# Altium schematic sheet nuc972_power.SchDoc
size A4
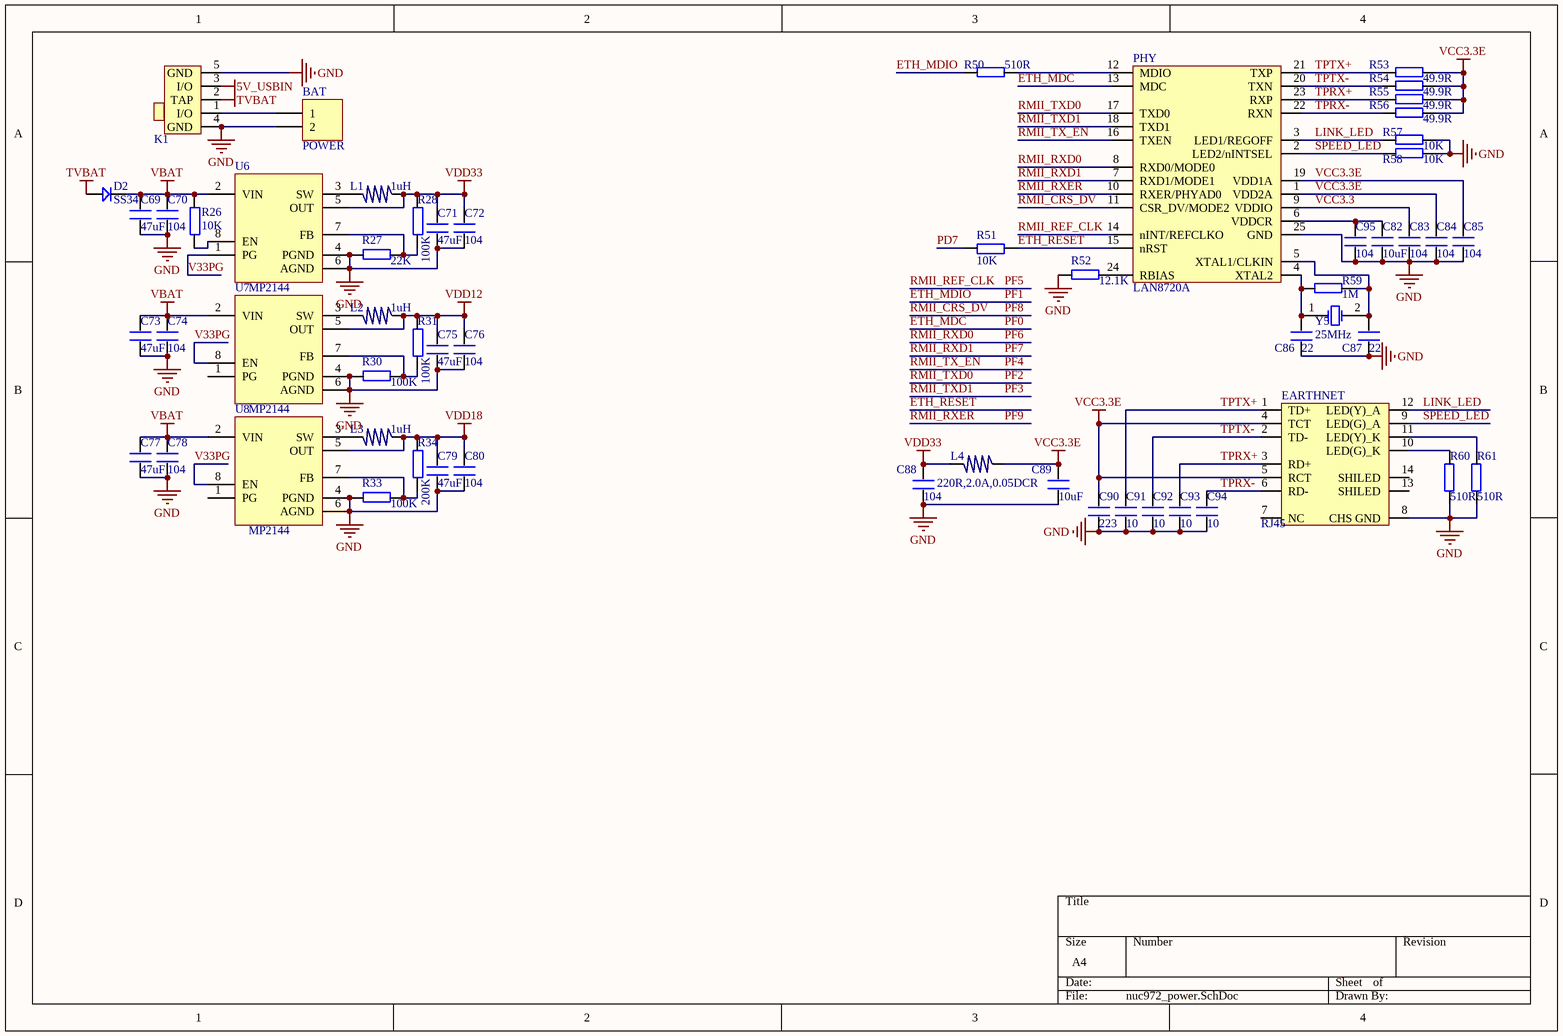
[diagram p0: nuc972_power.SchDoc]

## Parts
BAT  POWER  [HDR1X2]
C69  47uF  [C 0805_L]
C70  104  [C 0603_L]
C71  47uF  [C 0805_L]
C72  104  [C 0603_L]
C73  47uF  [C 0805_L]
C74  104  [C 0603_L]
C75  47uF  [C 0805_L]
C76  104  [C 0603_L]
C77  47uF  [C 0805_L]
C78  104  [C 0603_L]
C79  47uF  [C 0805_L]
C80  104  [C 0603_L]
C82  10uF  [C 0603_L]
C83  104  [C 0603_L]
C84  104  [C 0603_L]
C85  104  [C 0603_L]
C86  22  [C 0603_L]
C87  22  [C 0603_L]
C88  104  [C 0603_L]
C89  10uF  [C 0603_L]
C90  223  [C 0603_L]
C91  10  [C 0603_L]
C92  10  [C 0603_L]
C93  10  [C 0603_L]
C94  10  [C 0603_L]
C95  104  [C 0603_L]
D2  SS34  [SMA]
EARTHNET  RJ45  [RJ-45A12]
K1  BUTTON_DIP3  [BTN8.8*4.6]  (value not drawn)
L1  1uH  [NR3015]
L2  1uH  [NR3015]
L3  1uH  [NR3015]
L4  220R,2.0A,0.05DCR  [L 0603]
PHY  LAN8720A  [QFN24 4x4_N]
R26  10K  [R 0603_L]
R27  22K  [R 0603_L]
R28  100K  [R 0603_L]
R30  100K  [R 0603_L]
R31  100K  [R 0603_L]
R33  100K  [R 0603_L]
R34  200K  [R 0603_L]
R50  510R  [R 0603_L]
R51  10K  [R 0603_L]
R52  12.1K  [R 0603_L]
R53  49.9R  [R 0603_L]
R54  49.9R  [R 0603_L]
R55  49.9R  [R 0603_L]
R56  49.9R  [R 0603_L]
R57  10K  [R 0603_L]
R58  10K  [R 0603_L]
R59  1M  [R 0603_L]
R60  510R  [R 0603_L]
R61  510R  [R 0603_L]
U6  MP2144  [SOT23-8L]
U7  MP2144  [SOT23-8L]
U8  MP2144  [SOT23-8L]
Y5  25MHz  [OSC HC-49S]

## Nets
5V_USBIN: K1.3(I/O)
GND: BAT.2 C69.1 C70.1 C71.1 C72.1 C73.1 C74.1 C75.1 C76.1 C77.1 C78.1 C79.1 C80.1 C82.1 C83.2 C84.2 C85.2 C86.2 C87.2 C88.2 C89.2 C90.2 C91.2 C92.2 C93.2 C94.2 C95.2 EARTHNET.8(CHS_GND) K1.4(GND) K1.5(GND) PHY.25(GND) R27.2 R30.2 R33.2 R52.2 R57.1 R58.1 R60.2 R61.2 U6.4(PGND) U6.6(AGND) U7.4(PGND) U7.6(AGND) U8.4(PGND) U8.6(AGND)
TVBAT: D2.1 K1.2(TAP)
VBAT: C69.2 C70.2 C73.2 C74.2 C77.2 C78.2 D2.2 R26.2 U6.2(VIN) U7.2(VIN) U8.2(VIN)
VCC3.3E: C84.1 C85.1 C89.1 C90.1 EARTHNET.4(TCT) EARTHNET.5(RCT) L4.1 PHY.1(VDD2A) PHY.19(VDD1A) R53.1 R54.1 R55.1 R56.1
VDD12: C75.2 C76.2 L2.1 R31.2 U7.5(OUT)
VDD18: C79.2 C80.2 L3.1 R34.2 U8.5(OUT)
VDD33: C71.2 C72.2 C88.1 L1.1 L4.2 R28.2 U6.5(OUT)
ETH_MDC: PHY.13(MDC)  [also labelled PF0]
ETH_MDIO: R50.2  [also labelled PF1]
ETH_RESET: PHY.15(nRST) R51.2
LINK_LED: EARTHNET.12(LED(Y)_A) PHY.3(LED1/REGOFF) R57.2
PD7: R51.1
PF2: PHY.17(TXD0)  [also labelled RMII_TXD0]
PF3: PHY.18(TXD1)  [also labelled RMII_TXD1]
PF4: PHY.16(TXEN)  [also labelled RMII_TX_EN]
PF5: PHY.14(nINT/REFCLKO)  [also labelled RMII_REF_CLK]
PF6: PHY.8(RXD0/MODE0)  [also labelled RMII_RXD0]
PF7: PHY.7(RXD1/MODE1)  [also labelled RMII_RXD1]
PF8: PHY.11(CSR_DV/MODE2)  [also labelled RMII_CRS_DV]
PF9: PHY.10(RXER/PHYAD0)  [also labelled RMII_RXER]
SPEED_LED: EARTHNET.9(LED(G)_A) PHY.2(LED2/nINTSEL) R58.2
TPRX+: C93.1 EARTHNET.3(RD+) PHY.23(RXP) R55.2
TPRX-: C94.1 EARTHNET.6(RD-) PHY.22(RXN) R56.2
TPTX+: C91.1 EARTHNET.1(TD+) PHY.21(TXP) R53.2
TPTX-: C92.1 EARTHNET.2(TD-) PHY.20(TXN) R54.2
V33PG: U6.1(PG) U7.8(EN) U8.8(EN)
VCC3.3: C83.1 PHY.9(VDDIO)
NetBAT_1: BAT.1 K1.1(I/O)
NetC82_2: C82.2 C95.1 PHY.6(VDDCR)
NetC86_1: C86.1 PHY.4(XTAL2) R59.2 Y5.1(OSC1)
NetC87_1: C87.1 PHY.5(XTAL1/CLKIN) R59.1 Y5.2(OSC2)
NetEARTHNET_10: EARTHNET.10(LED(G)_K) R60.1
NetEARTHNET_11: EARTHNET.11(LED(Y)_K) R61.1
NetL1_2: L1.2 U6.3(SW)
NetL2_2: L2.2 U7.3(SW)
NetL3_2: L3.2 U8.3(SW)
NetPHY_12: PHY.12(MDIO) R50.1
NetPHY_24: PHY.24(RBIAS) R52.1
NetR26_1: R26.1 U6.8(EN)
NetR27_1: R27.1 R28.1 U6.7(FB)
NetR30_1: R30.1 R31.1 U7.7(FB)
NetR33_1: R33.1 R34.1 U8.7(FB)

Not connected (* = marked no-connect by the designer): EARTHNET 7(NC) 13(SHILED) 14(SHILED); U7 1(PG); U8 1(PG)

## Library data of the parts
BAT = Header 2: Header, 2-Pin; LatestRevisionDate: 17-Jul-2002; LatestRevisionNote: Re-released for DXP Platform.; Publisher: Altium Limited
C69-C80 C82-C95 = C
D2 = D
EARTHNET = HR911105
K1 = BUTTON_DIP3: 拨动开关SS-12F44
L1-L4 = L
PHY = LAN8720: ETH PHY
R26-R28 R30 R31 R33 R34 R50-R61 = R
Y5 = XTAL: Crystal Oscillator; Published: 8-Jun-2000; LatestRevisionDate: 17-Jul-2002; LatestRevisionNote: Re-released for DXP Platform.; Publisher: Altium Limited